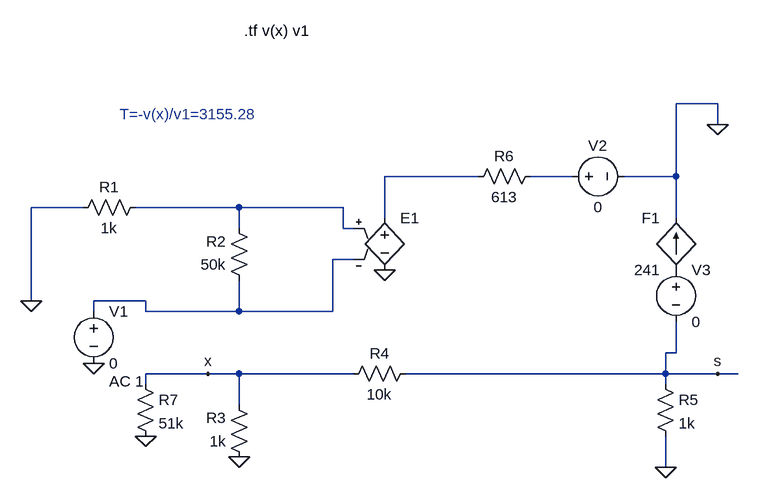
[diagram p0: schematic real_T3.asc]
real_T3.asc, the LTspice schematic file:
Version 4
SHEET 1 1376 1092
WIRE 752 -32 688 -32
WIRE 752 0 752 -32
WIRE 384 80 240 80
WIRE 528 80 464 80
WIRE 688 80 688 -32
WIRE 688 80 608 80
WIRE -224 128 -304 128
WIRE 16 128 -144 128
WIRE 176 128 16 128
WIRE 240 144 240 80
WIRE 688 144 688 80
WIRE 16 160 16 128
WIRE 176 160 176 128
WIRE 192 160 176 160
WIRE 192 208 160 208
WIRE -304 272 -304 128
WIRE -128 272 -208 272
WIRE -208 288 -208 272
WIRE -128 288 -128 272
WIRE 16 288 16 240
WIRE 16 288 -128 288
WIRE 160 288 160 208
WIRE 160 288 16 288
WIRE 688 352 688 304
WIRE 688 352 672 352
WIRE -32 384 -128 384
WIRE 16 384 -32 384
WIRE 192 384 16 384
WIRE 672 384 672 352
WIRE 672 384 272 384
WIRE 752 384 672 384
WIRE 784 384 752 384
WIRE -128 400 -128 384
WIRE 672 400 672 384
WIRE 16 432 16 384
WIRE 672 528 672 480
FLAG 240 224 0
FLAG -304 272 0
FLAG 16 512 0
FLAG 672 528 0
FLAG 752 0 0
FLAG 752 384 s
FLAG -128 480 0
FLAG -208 368 0
FLAG -32 384 x
SYMBOL e 240 128 R0
WINDOW 3 24 96 Invisible 2
SYMATTR Value -100/(1+s/62831.8)
SYMATTR InstName E1
SYMATTR SpiceModel laplace
SYMBOL res -128 112 R90
WINDOW 0 0 56 VBottom 2
WINDOW 3 32 56 VTop 2
SYMATTR InstName R1
SYMATTR Value 1k
SYMBOL res 32 256 R180
WINDOW 0 36 76 Left 2
WINDOW 3 36 40 Left 2
SYMATTR InstName R2
SYMATTR Value 50k
SYMBOL res 32 528 R180
WINDOW 0 36 76 Left 2
WINDOW 3 36 40 Left 2
SYMATTR InstName R3
SYMATTR Value 1k
SYMBOL res 176 400 R270
WINDOW 0 32 56 VTop 2
WINDOW 3 0 56 VBottom 2
SYMATTR InstName R4
SYMATTR Value 10k
SYMBOL res 656 384 R0
SYMATTR InstName R5
SYMATTR Value 1k
SYMBOL res 480 64 R90
WINDOW 0 0 56 VBottom 2
WINDOW 3 32 56 VTop 2
SYMATTR InstName R6
SYMATTR Value 613
SYMBOL voltage 512 80 R270
WINDOW 0 32 56 VTop 2
WINDOW 3 -32 56 VBottom 2
WINDOW 123 0 0 Left 0
WINDOW 39 0 0 Left 0
SYMATTR InstName V2
SYMATTR Value 0
SYMBOL f 688 224 R180
WINDOW 0 24 80 Left 2
WINDOW 3 24 0 Left 2
SYMATTR InstName F1
SYMATTR Value 241
SYMATTR SpiceModel v2
SYMBOL voltage 688 208 R0
WINDOW 123 0 0 Left 0
WINDOW 39 0 0 Left 0
SYMATTR InstName V3
SYMATTR Value 0
SYMBOL res -144 384 R0
SYMATTR InstName R7
SYMATTR Value 51k
SYMBOL voltage -208 272 R0
WINDOW 123 24 124 Left 2
WINDOW 39 0 0 Left 0
SYMATTR InstName V1
SYMATTR Value 0
SYMATTR Value2 AC 1
TEXT 24 -144 Left 2 !.tf v(x) v1
TEXT -168 -16 Left 2 ;T=-v(x)/v1=3155.28

The netlist it stands for:
* real_T3.asc
E1 N001 0 N003 N004 laplace -100/(1+s/62831.8)
R1 N003 0 1k
R2 N004 N003 50k
R3 0 x 1k
R4 x s 10k
R5 s 0 1k
R6 N002 N001 613
V2 N002 0 0
F1 P001 0 v2 241
V3 P001 s 0
R7 x 0 51k
V1 N004 0 0 AC 1
.tf v(x) v1
* T=-v(x)/v1=3155.28
.backanno
.end